# EAGLE design ccu_board (EAGLE 9.3.0)
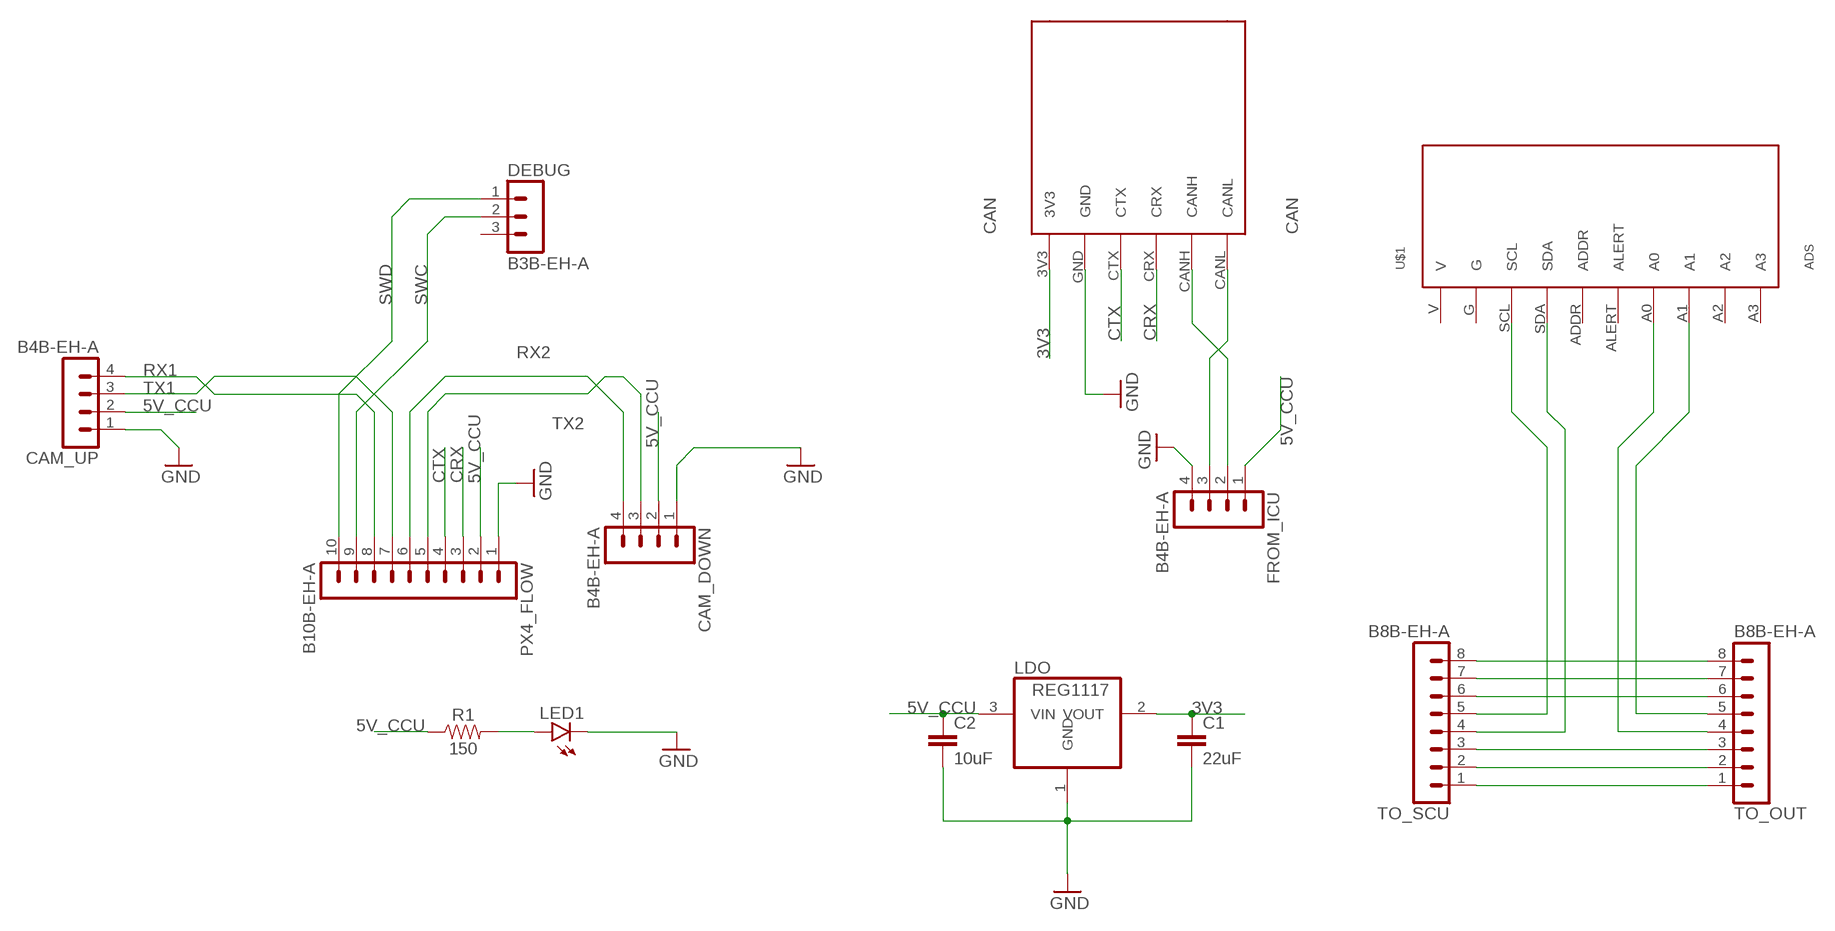
[diagram p0: schematic, sheet 1]

## Parts
C1  22uF  22UF-0805-6.3V-20%  [0805]
C2  10uF  22UF-0805-16V-20%  [0805]
CAM_DOWN  B4B-EH-A  [B4B-EH-A]
CAM_UP  B4B-EH-A  [B4B-EH-A]
CAN  CAN  [CAN]
DEBUG  B3B-EH-A  [B3B-EH-A]
FROM_ICU  B4B-EH-A  [B4B-EH-A]
LDO  REG1117  [SOT223]
LED1  LED5MM  [LED5MM]
PX4_FLOW  B10B-EH-A  [B10B-EH-A]
R1  150  RESISTORAXIAL-0.3  [AXIAL-0.3]
TO_OUT  B8B-EH-A  [B8B-EH-A]
TO_SCU  B8B-EH-A  [B8B-EH-A]
U$1  ADS  [ADS]

## Nets
3V3: C1.1 CAN.3V3 LDO.2(VOUT)
5V_CCU: C2.1 CAM_DOWN.2 CAM_UP.2 FROM_ICU.1 LDO.3(VIN) PX4_FLOW.2 R1.P$1
CRX: CAN.CRX PX4_FLOW.3
CTX: CAN.CTX PX4_FLOW.4
GND: C1.2 C2.2 CAM_DOWN.1 CAM_UP.1 CAN.GND FROM_ICU.4 LDO.1(GND) LED1.K(C) PX4_FLOW.1
N$1: TO_OUT.8 TO_SCU.8
N$2: TO_OUT.7 TO_SCU.7
N$3: TO_OUT.6 TO_SCU.6
N$4: TO_OUT.3 TO_SCU.3
N$5: TO_OUT.2 TO_SCU.2
N$6: CAN.CANL FROM_ICU.3
N$7: TO_OUT.1 TO_SCU.1
N$8: CAN.CANH FROM_ICU.2
N$9: TO_SCU.5 U$1.SCL
N$10: TO_SCU.4 U$1.SDA
N$11: LED1.A R1.P$2
N$12: TO_OUT.5 U$1.A1
N$13: TO_OUT.4 U$1.A0
RX1: CAM_UP.4 PX4_FLOW.8
RX2: CAM_DOWN.4 PX4_FLOW.6
SWC: DEBUG.2 PX4_FLOW.9
SWD: DEBUG.1 PX4_FLOW.10
TX1: CAM_UP.3 PX4_FLOW.7
TX2: CAM_DOWN.3 PX4_FLOW.5
Unconnected: DEBUG.3 U$1.A2 U$1.A3 U$1.ADDR U$1.ALERT U$1.G U$1.V

## Library data of the parts
C1 = SparkFun-Capacitors:22UF: 22µF ceramic capacitors A capacitor is a passive two-terminal electrical component used to store electrical energy temporarily in an electric field.; PROD_ID: CAP-08402
C2 = SparkFun-Capacitors:22UF: 22µF ceramic capacitors A capacitor is a passive two-terminal electrical component used to store electrical energy temporarily in an electric field.; PROD_ID: CAP-14260; VALUE: 22uF
CAM_DOWN CAM_UP FROM_ICU = con-jst-eh:B4B-EH-A: HEADER
CAN = bluepill:CAN
DEBUG = con-jst-eh:B3B-EH-A: HEADER
LDO = burr-brown:REG1117: 800mA and 1A Low Dropout (LDO) Positive Regulator 1.8V, 2.5V, 2.85V, 3.3V, 5V, and Adj; MPN: REG1117; OC_FARNELL: 1097566; OC_NEWARK: 14P6981
LED1 = led:LED: LED OSRAM: - CHIPLED LG R971, LG N971, LY N971, LG Q971, LY Q971, LO R971, LY R971 LH N974, LH R974 LS Q976, LO Q976, LY Q976 LO Q996 - Hyper CHIPLED LW Q18S LB Q993, LB Q99A, LB R99A - SideLED LS A670, LO A670, LY A670, LG A670, LP A670 LB A673, LV A673, LT A673, LW A673 LH A674 LY A675 LS A676, LA A676, LO A676, LY A676, LW A676 LS A679, LY A679, LG A679 - Hyper Micro SIDELED® LS Y876, LA Y876, LO Y876, LY Y876 LT Y87S - SmartLED LW L88C, LW L88S LB L89C, LB L89S, LG L890 LS L89K, LO L89K, LY L89K LS L896, LA L896, LO L896, LY L896 - TOPLED LS T670, LO T670, LY T670, LG T670, LP T670 LSG T670, LSP T670, LSY T670, LOP T670, LYG T670 LG T671, LOG T671, LSG T671 LB T673, LV T673, LT T673, LW T673 LH T674 LS T676, LA T676, LO T676, LY T676, LB T676, LH T676, LSB T676, LW T676 LB T67C, LV T67C, LT T67C, LS T67K, LO T67K, LY T67K, LW E67C LS E67B, LA E67B, LO E67B, LY E67B, LB E67C, LV E67C, LT E67C LW T67C LS T679, LY T679, LG T679 LS T770, LO T770, LY T770, LG T770, LP T770 LB T773, LV T773, LT T773, LW T773 LH T774 LS E675, LA E675, LY E675, LS T675 LS T776, LA T776, LO T776, LY T776, LB T776 LHGB T686 LT T68C, LB T68C - Hyper Mini TOPLED® LB M676 - Mini TOPLED Santana® LG M470 LS M47K, LO M47K, LY M47K Source: http://www.osram.convergy.de LUXEON: - LUMILED® LXK2-PW12-R00, LXK2-PW12-S00, LXK2-PW14-U00, LXK2-PW14-V00 LXK2-PM12-R00, LXK2-PM12-S00, LXK2-PM14-U00 LXK2-PE12-Q00, LXK2-PE12-R00, LXK2-PE12-S00, LXK2-PE14-T00, LXK2-PE14-U00 LXK2-PB12-K00, LXK2-PB12-L00, LXK2-PB12-M00, LXK2-PB14-N00, LXK2-PB14-P00, LXK2-PB14-Q00 LXK2-PR12-L00, LXK2-PR12-M00, LXK2-PR14-Q00, LXK2-PR14-R00 LXK2-PD12-Q00, LXK2-PD12-R00, LXK2-PD12-S00 LXK2-PH12-R00, LXK2-PH12-S00 LXK2-PL12-P00, LXK2-PL12-Q00, LXK2-PL12-R00 Source: www.luxeon.com KINGBRIGHT: KA-3528ASYC Source: www.kingbright.com
PX4_FLOW = con-jst-eh:B10B-EH-A: HEADER
R1 = SparkFun-Resistors:RESISTOR: Generic Resistor Package
TO_OUT TO_SCU = con-jst-eh:B8B-EH-A: HEADER
U$1 = bluepill:ADS

## Board
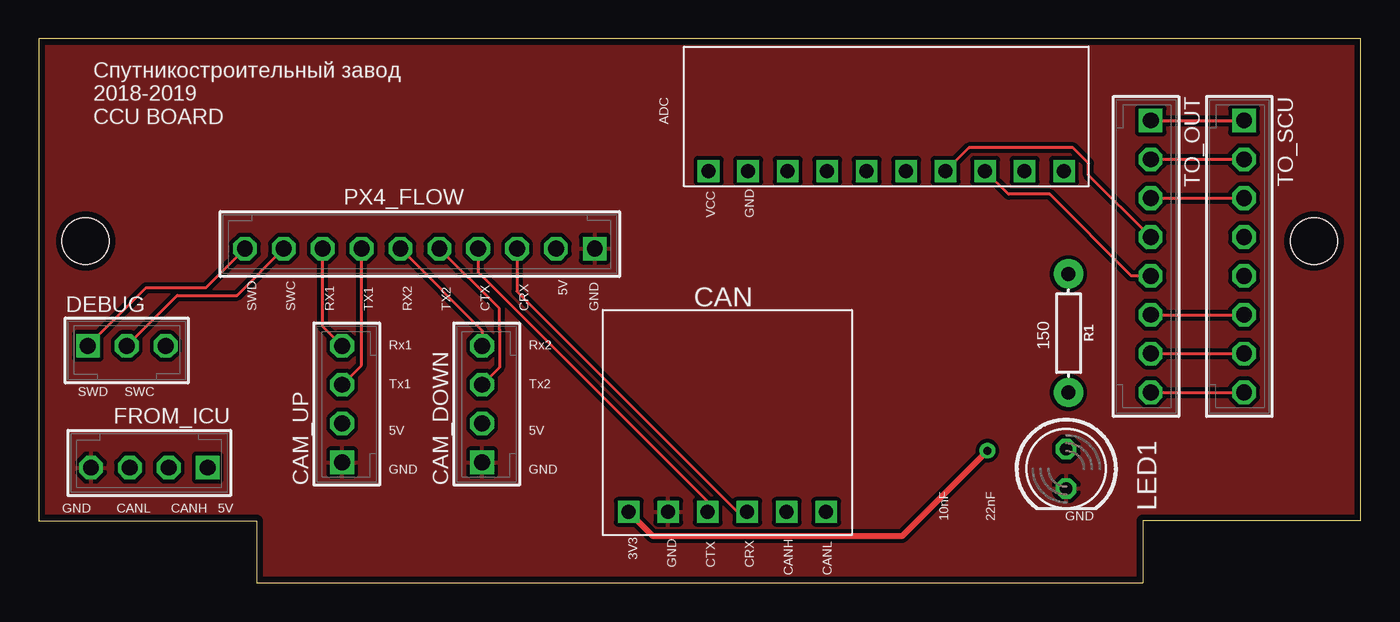
[diagram p1: board, top side]
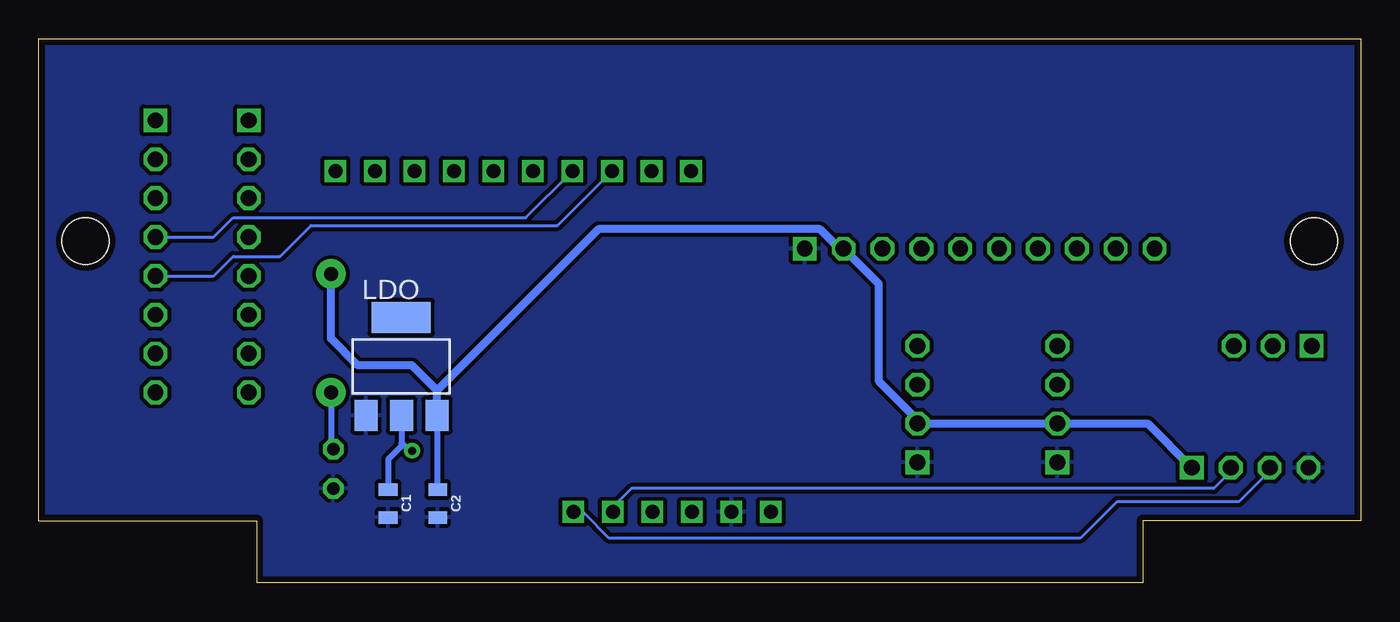
[diagram p2: board, bottom side, seen from below]

Size 85 x 35 mm. Coordinates in mm from the lower left corner, seen from the top.
Outline: 14,0 71,0 71,4 85,4 85,35 0,35 0,4 14,4 14,0
Copper layers (1*16): Top 0.035mm / dielectric 1mm / Bottom 0.035mm
Design rules "rezonit": minimum track width 0.2mm, minimum drill 0.5mm, track to track 0.25mm, track to pad 0.25mm, pad to pad 0.25mm, via to via 0.25mm, smd to smd 0.2mm, copper to edge 0.4mm, drill to drill 0.4mm, minimum pad ring 0.25mm, minimum via ring 0.25mm, stop-mask expansion 4mil, vias tented up to drill 0.6mm, thermal gap 10mil
Holes 3 mm at 3,22 82,22

### Footprints (pad centres in the part's own frame; a part is rotated, then mirrored left to right if it is on the bottom)
0805 = smd 0.8 x 1.2: 1 -0.9,0; 2 0.9,0
B4B-EH-A = drill 1.016 square: 1 -3.75,0 | drill 1.016 octagon: 2 -1.25,0; 3 1.25,0; 4 3.75,0
CAN = drill 0.9 square: 3V3 -5.75,6.35; CANH -5.75,-3.81; CANL -5.75,-6.35; CRX -5.75,-1.27; CTX -5.75,1.27; GND -5.75,3.81
B3B-EH-A = drill 1.016 square: 1 -2.5,0 | drill 1.016 octagon: 2 0,0; 3 2.5,0
SOT223 = smd 1.499 x 2.007: 1 -2.261,-3.15; 2 0.025,-3.15; 3 2.311,-3.15 | smd 3.81 x 2.007: 4 0,3.15
LED5MM = drill 0.813 octagon: A -1.27,0; K 1.27,0
B10B-EH-A = drill 1.016 square: 1 -11.25,0 | drill 1.016 octagon: 2 -8.75,0; 3 -6.25,0; 4 -3.75,0; 5 -1.25,0; 6 1.25,0; 7 3.75,0; 8 6.25,0; 9 8.75,0; 10 11.25,0
AXIAL-0.3 = drill 0.9 pad 1.88: P$1 -3.81,0; P$2 3.81,0
B8B-EH-A = drill 1.016 square: 1 -8.75,0 | drill 1.016 octagon: 2 -6.25,0; 3 -3.75,0; 4 -1.25,0; 5 1.25,0; 6 3.75,0; 7 6.25,0; 8 8.75,0
ADS = drill 0.9 square: A0 -3.5,-3.81; A1 -3.5,-6.35; A2 -3.5,-8.89; A3 -3.5,-11.43; ADDR -3.5,1.27; ALERT -3.5,-1.27; G -3.5,8.89; SCL -3.5,6.35; SDA -3.5,3.81; V -3.5,11.43

### Placement (x,y rotation side)
C1  62.54,5.11 270 bottom
C2  59.35,5.11 270 bottom
CAM_DOWN  28.5,11.5 90 top
CAM_UP  19.5,11.5 90 top
CAN  44.28,10.32 90 top
DEBUG  5.65,15.25 0 top
FROM_ICU  7.1,7.41 180 top
LDO  61.7,13.93 0 bottom
LED1  66.07,7.34 270 top
PX4_FLOW  24.5,21.5 180 top
R1  66.22,16.07 270 top
TO_OUT  71.5,21 270 top
TO_SCU  77.5,21 270 top
U$1  54.5,30 90 top

### Tracks (layer width: path | path; a pad name or v marks a point on that pad's centre or on a via)
3V3  (via drill 0.5)
  Top 0.4: v61,8.5 55.5,3 39.5,3 CAN.3V3
  Bottom 0.4: LDO.2 61.67,9 | 61.67,9 61.67,8.82 62.54,7.96 C1.1 | 61.67,9 61.17,8.5 v61,8.5
5V_CCU
  Bottom 0.4: LDO.3 59.39,6.05 C2.1
  Bottom 0.5: 59.39,12.39 49.02,22.76 34.78,22.76 33.52,21.5 PX4_FLOW.2 31,19.25 31,13 28.5,10.5 CAM_DOWN.2 CAM_UP.2 13.69,10.25 FROM_ICU.1 | LDO.3 59.39,12.39 | 59.39,12.39 61,14 64.5,14 66.22,15.72 R1.P$1
CRX
  Top 0.2: PX4_FLOW.3 30.75,18.75 44.93,4.57 CAN.CRX
CTX
  Top 0.2: PX4_FLOW.4 28.25,20 43.01,5.24 CAN.CTX
GND
  pour Top: 0,35 0,4 14,4 14,0 71,0 71,4 85,4 85,35
  pour Bottom: 0,35 0,4 14,4 14,0 71,0 71,4 85,4 85,35
N$1
  Top 0.2: TO_OUT.8 TO_SCU.8
N$2
  Top 0.2: TO_OUT.7 TO_SCU.7
N$3
  Top 0.2: TO_OUT.6 TO_SCU.6
N$4
  Top 0.2: TO_OUT.3 TO_SCU.3
N$5
  Top 0.2: TO_OUT.2 TO_SCU.2
N$6
  Bottom 0.2: CAN.CANL 50.62,4.5 49.95,4.5 48.33,2.88 18.02,2.88 15.68,5.22 7.83,5.22 5.85,7.2 FROM_ICU.3
N$7
  Top 0.2: TO_OUT.1 TO_SCU.1
N$8
  Bottom 0.2: CAN.CANH 48.09,4.88 46.9,6.08 9.45,6.08 8.32,7.2 FROM_ICU.2
N$9
  Bottom 0.2: TO_SCU.5 73.75,19.75 72.5,21 69.5,21 67.5,23 51.65,23 U$1.SCL
N$10
  Bottom 0.2: TO_SCU.4 73.75,22.25 72.5,23.5 53.69,23.5 U$1.SDA
N$11
  Bottom 0.4: R1.P$2 66.22,8.76 LED1.A
N$12
  Top 0.2: TO_OUT.5 70.25,19.75 65,25 62.35,25 U$1.A1
N$13
  Top 0.2: TO_OUT.4 67.5,26.25 67.5,27 66.5,28 59.81,28 U$1.A0
RX1
  Top 0.2: CAM_UP.4 18.25,16.5 PX4_FLOW.8
RX2
  Top 0.2: PX4_FLOW.6 28.5,16.25 CAM_DOWN.4
SWC
  Top 0.2: DEBUG.2 8.9,18.5 12.75,18.5 PX4_FLOW.9
SWD
  Top 0.2: DEBUG.1 6.9,19 10.75,19 PX4_FLOW.10
TX1
  Top 0.2: CAM_UP.3 20.75,14 PX4_FLOW.7
TX2
  Top 0.2: PX4_FLOW.5 29.61,17.64 29.61,16.5 29.61,16.29 29.61,13.86 CAM_DOWN.3

### Text on the board
tPlace: Спутникостроительный завод / 2018-2019 / CCU BOARD | ADC | VCC | GND | SWD | SWC | RX1 | TX1 | RX2 | TX2 | CTX | CRX | 5V | GND | Rx1 | Rx2 | 150 | SWD | SWC | Tx1 | Tx2 | 5V | 5V | GND | GND | GND | CANL | CANH | 5V | 10nF | 22nF | GND | 3V3 | GND | CTX | CRX | CANH | CANL